# Altium schematic sheet 1_IMU Connector.schdoc
size 307 x 218 mm; Symbol: Drawing-Symbol_A4; Device: Drawing-Symbol_A4; @Project Name: PowerManagement Board for Rpi; @Page Count: 1; @Update Date: 2025-01-31; @Create Date: 2025-01-23; @Schematic Name: IMU Connector; @Page No: 1; @Page Name: IMU Connector; Company: EasyEDA.com; Version: V1.0; Page Size: A4; @Create Time: 21:23:01; @Update Time: 12:54:18; Width: 1170; Height: 825; Region Start: 1; X Region Count: 6; Y Region Count: 4; Blade Width: 10; Title Block Position: 3; @Board Name: Board2
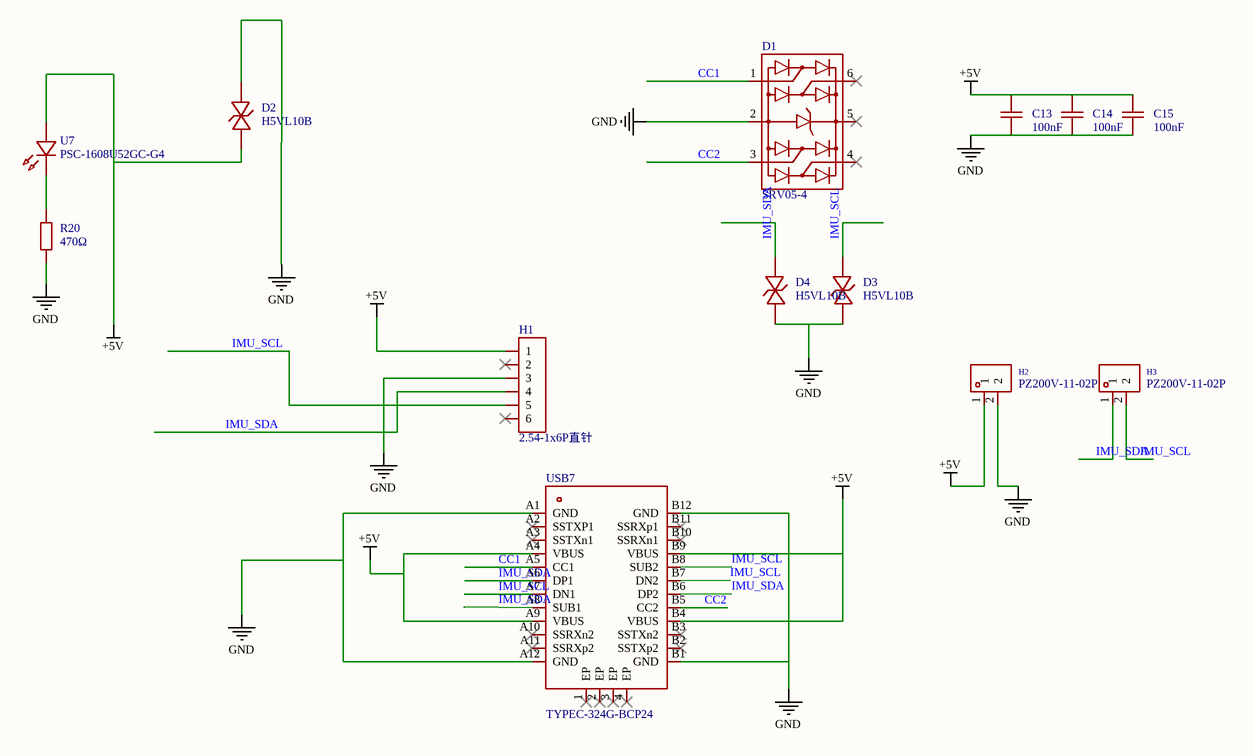
[diagram p0: 1_IMU Connector.schdoc]

## Parts
C13  100nF  [C0805]
C14  100nF  [C0805]
C15  100nF  [C0805]
D1  SRV05-4  [SOT-23-6_L2.9-W1.6-P0.95-LS2.8-BL]
D2  H5VL10B  [SOD-882_L1.0-W0.6-BI]
D3  H5VL10B  [SOD-882_L1.0-W0.6-BI]
D4  H5VL10B  [SOD-882_L1.0-W0.6-BI]
H1  2.54-1x6P直针  [HDR-TH_6P-P2.54-V-M-1]
H2  PZ200V-11-02P  [HDR-TH_2P-P2.00-V-M]
H3  PZ200V-11-02P  [HDR-TH_2P-P2.00-V-M]
R20  470Ω  [R0603]
U7  PSC-1608U52GC-G4  [LED0603-RD_GREEN]
USB7  TYPEC-324G-BCP24  [USB-C-SMD_TYPEC-324G-BCP24]

## Nets
+5V: C13.2 C14.2 C15.2 D2.1(C) H1.1 H2.1 U7.2(A) USB7.A4(VBUS) USB7.A9(VBUS) USB7.B4(VBUS) USB7.B9(VBUS)
GND: C13.1 C14.1 C15.1 D1.2 D2.2(A) D3.1(C) D4.1(C) H1.3 H2.2 R20.1 USB7.A1(GND) USB7.A12(GND) USB7.B1(GND) USB7.B12(GND)
CC1: D1.1 USB7.A5(CC1)
CC2: D1.3 USB7.B5(CC2)
IMU_SCL: D3.2(A) H1.5 H3.2 USB7.A7(DN1) USB7.B7(DN2) USB7.B8(SUB2)
IMU_SDA: D4.2(A) H1.4 H3.1 USB7.A6(DP1) USB7.A8(SUB1) USB7.B6(DP2)
NetR20_2: R20.2 U7.1(K)

Not connected (* = marked no-connect by the designer): D1 4* 5* 6*; H1 2* 6*; USB7 1(EP)* 2(EP)* 3(EP)* 4(EP)* A2(SSTXP1)* A3(SSTXn1)* A10(SSRXn2)* A11(SSRXp2)* B2(SSTXp2)* B3(SSTXn2)* B10(SSRXn1)* B11(SSRXp1)*

## Notes on the sheet
- 1
- 2
- 3
- 4
- 5
- 6
- A
- B
- C
- Schematic
- IMU Connector
- Create at
- Update at
- 2025-01-23
- 2025-01-31
- Board
- Drawn
- Board2
- Page
- D
- Reviewed
- Version
- Size
- PowerManagement Board for Rpi
- Page  1  Total  1
- V1.0
- A4
- EasyEDA.com

## Library data of the parts
C13-C15 = CL21B104KBCNNNC: Manufacturer: SAMSUNG(三星); Add into BOM: yes; Tolerance: ±10%; Symbol: CL21B104KBCNNNC; Device: CL21B104KBCNNNC; LCSC Part Name: 100nF ±10% 50V; Supplier Part: C1711; Manufacturer Part: CL21B104KBCNNNC; Supplier Footprint: 0805; JLCPCB Part Class: Extended Part; Datasheet: https://atta.szlcsc.com/upload/public/pdf/source/20160218/1457707763339.pdf; Supplier: LCSC; Convert to PCB: yes; Value: 100nF
D1 = SRV05-4_C558418: Manufacturer: TECH PUBLIC(台舟); Add into BOM: yes; polarity: Unidirectional; Reverse Stand-Off Voltage (Vrwm): 5V; Maximum Clamping Voltage: 20V; Peak Pulse Current (Ipp): 3A; Peak Pulse Power Dissipation (Ppp): 60W; Breakdown Voltage: 6V; Reverse Leakage Current (Ir): 500nA; Number of Lines: Four channels; level of protection: IEC 61000-4-2; Type: ESD; Symbol: SRV05-4_C558418; Device: SRV05-4_C558418; LCSC Part Name: ESD，可防25kV静电; Supplier Part: C558418; Manufacturer Part: SRV05-4; Supplier Footprint: SOT-23-6; JLCPCB Part Class: Extended Part; Datasheet: https://atta.szlcsc.com/upload/public/pdf/source/20230615/CFFDFFE99FDA0E92DF9600783B3A2A20.pdf; Supplier: LCSC; Convert to PCB: yes; Operating Temperature: -55℃~+125℃
D2-D4 = H5VL10B: Manufacturer: 宏迦橙; Add into BOM: yes; polarity: Bidirectional; Reverse Stand-Off Voltage (Vrwm): 5V; Maximum Clamping Voltage: 10V; Peak Pulse Current (Ipp): 5A; Peak Pulse Power Dissipation (Ppp): 50W; Breakdown Voltage: 5.6V; Reverse Leakage Current (Ir): 100nA; Number of Lines: Single channel; Type: ESD; Symbol: H5VL10B; Device: H5VL10B; LCSC Part Name: H5VL10B 丝印 PB; Supplier Part: C7420372; Manufacturer Part: H5VL10B; Supplier Footprint: DFN1006-2L; JLCPCB Part Class: Extended Part; Datasheet: https://atta.szlcsc.com/upload/public/pdf/source/20230630/5024ECFEAD3C9801B07A8DBB967AB462.pdf; Supplier: LCSC; Convert to PCB: yes; Operating Temperature: -55℃~+155℃; level of protection: -; Junction Capacitance: -
H1 = 2.54-1x6P直针: Manufacturer: BOOMELE(博穆精密); Symbol: Header-Male-2.54_1x6; Add into BOM: yes; Pin Structure: 1x6P; Pitch: 2.54mm; Circluar Pins/Square Pins: Square Pins; Current Rating (Max): 3A; Device: 2.54-1x6P直针; LCSC Part Name: 间距:2.54mm 1x6P 直插 方针; Supplier Part: C37208; Manufacturer Part: 2.54-1x6P直针; Supplier Footprint: 插件,P=2.54mm; JLCPCB Part Class: Extended Part; Supplier: LCSC; Convert to PCB: yes; Row Spacing: -; Mounting Type: Straight; Number of Rows: Plugin; Number of Pins: 6P; Voltage Rating (Max): -; Length of Mating Pin: -; Insulation Height: -; Contact Plating: -; Operating Temperature Range: -40℃~+105℃; Color: Black
H2 H3 = PZ200V-11-02P: Manufacturer: XFCN(兴飞); Add into BOM: yes; Pin Structure: 1x2P; Pitch: 2mm; Circluar Pins/Square Pins: Square Pins; Symbol: PZ200V-11-02P; Device: PZ200V-11-02P; Supplier: LCSC; Supplier Part: C541856; Manufacturer Part: PZ200V-11-02P; JLCPCB Part Class: Extended Part; LCSC Part Name: 间距:2mm 1x2P 直插 方针; Supplier Footprint: 插件,P=2mm; Datasheet: https://atta.szlcsc.com/upload/public/pdf/source/20200518/C541858_7610F54454E936EFCDE06B655DF7C837.pdf; Convert to PCB: yes; Row Spacing: -; Mounting Type: Straight; Number of Rows: Plugin; Number of Pins: 2P; Current Rating (Max): -; Voltage Rating (Max): -; Length of Mating Pin: 3.9mm; Insulation Height: 2mm; Length of End Connection Pin: 2.8mm; Contact Plating: -; Operating Temperature Range: -40℃~+105℃; Soldering Temperature(Max): -; Color: Black
R20 = RC0603FR-07470RL: Manufacturer: YAGEO(国巨); Add into BOM: yes; Tolerance: ±1%; Temperature Coefficient: ±100ppm/℃; Symbol: RC0603FR-07470RL; Device: RC0603FR-07470RL; LCSC Part Name: 厚膜电阻 470Ω ±1% 100mW; Supplier Part: C114669; Manufacturer Part: RC0603FR-07470RL; Supplier Footprint: 0603; JLCPCB Part Class: Extended Part; Datasheet: https://atta.szlcsc.com/upload/public/pdf/source/20180821/C275644_0D56F95EFF785E7D9A1FEF436B37DA78.pdf; Supplier: LCSC; Convert to PCB: yes; Type: Thick Film Resistors; Value: 470Ω; Operating Temperature Range: -55℃~+155℃
U7 = PSC-1608U52GC-G4: Manufacturer: HONGLITRONIC(鸿利光电); Add into BOM: yes; Emitted Color: Green; Symbol: PSC-1608U52GC-G4; Device: PSC-1608U52GC-G4; LCSC Part Name: 钻孔1608低亮绿灯; Supplier Part: C22371297; Manufacturer Part: PSC-1608U52GC-G4; Supplier Footprint: 0603; JLCPCB Part Class: Extended Part; Datasheet: https://atta.szlcsc.com/upload/public/pdf/source/20240328/4E4686E4F5DB651C0553C7ABD92F986B.pdf; Supplier: LCSC; Convert to PCB: yes
USB7 = TYPEC-324G-BCP24: Manufacturer: XUNPU(讯普); Add into BOM: yes; Connector Type: Type-C; Gender: Female; Number of Contacts: 24P; Number of Ports: 1; Current Rating - Power (Max): 5A; Symbol: TYPEC-324G-BCP24; Device: TYPEC-324G-BCP24; LCSC Part Name: Type-C 母 卧贴; Supplier Part: C920230; Manufacturer Part: TYPEC-324G-BCP24; Supplier Footprint: SMD; JLCPCB Part Class: Extended Part; Datasheet: https://atta.szlcsc.com/upload/public/pdf/source/20240730/570E6E6917F128F926C9CCEF1574B0B5.pdf; Supplier: LCSC; Convert to PCB: yes; Standard: USB 3.1; Mounting Style: Horizontal attachment; Operating Temperature Range: -45℃~+85℃